# Altium schematic sheet Power Supply.SchDoc
size A4; SheetNumber: 8; SheetTotal: 8
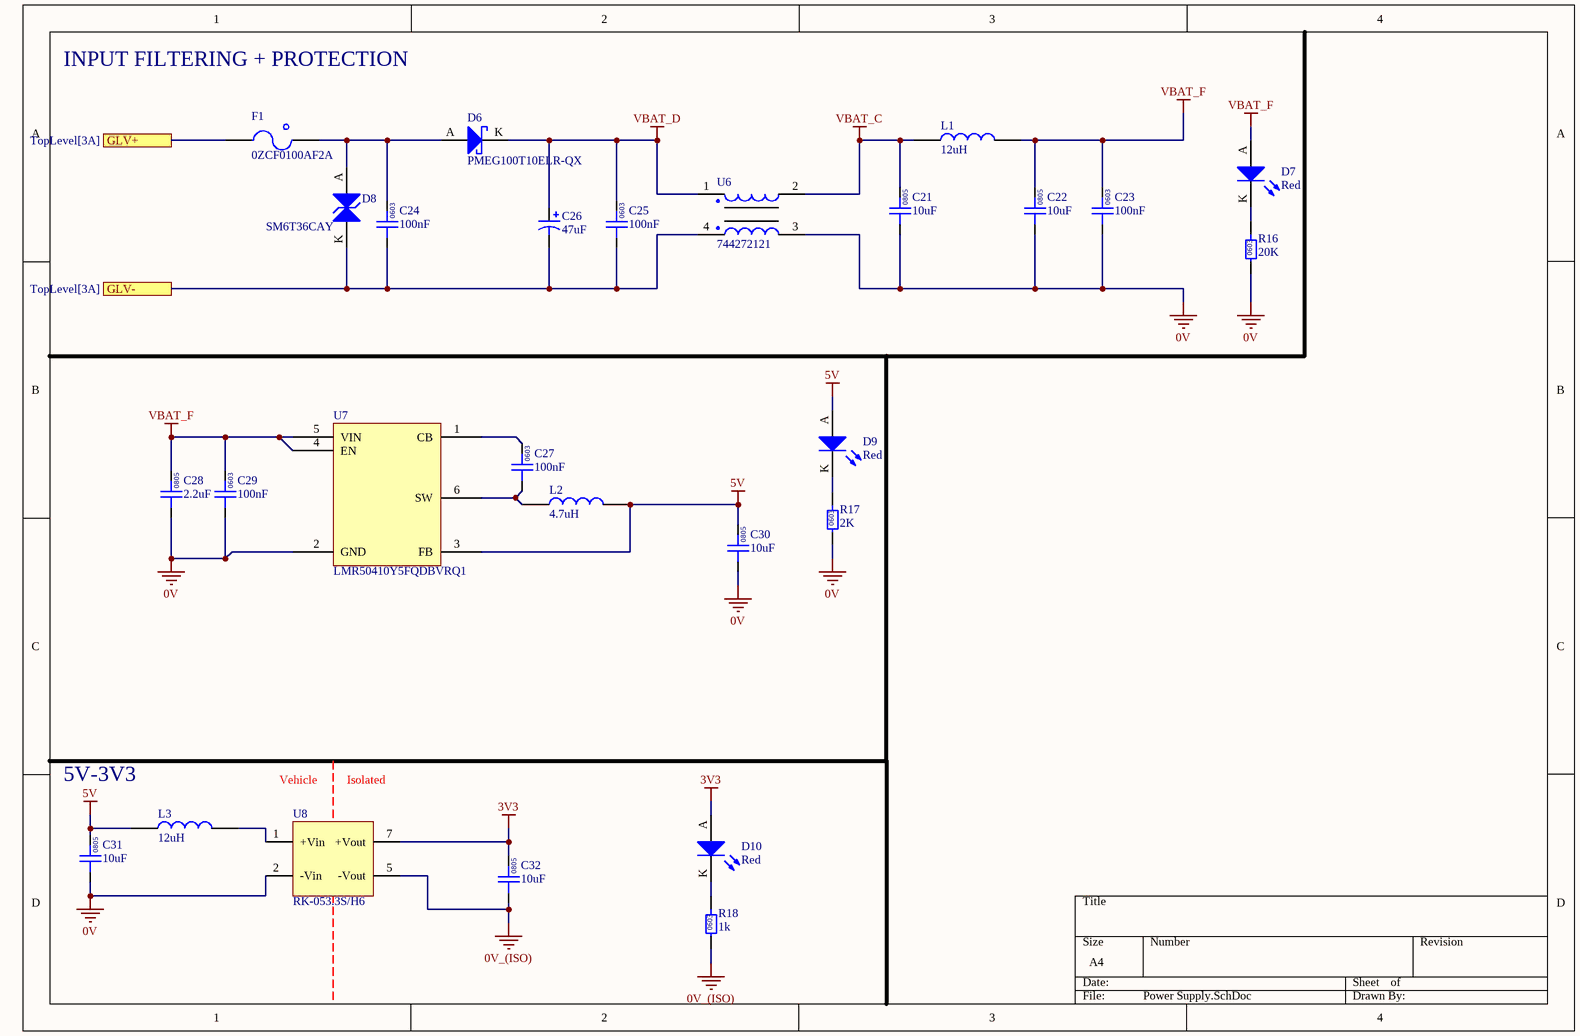
[diagram p0: Power Supply.SchDoc]

## Parts
C21  10uF  [0805]
C22  10uF  [0805]
C23  100nF  [0603]
C24  100nF  [0603]
C25  100nF  [0603]
C26  47uF  [CHEMI-CON ELCO]
C27  100nF  [0603]
C28  2.2uF  [0805]
C29  100nF  [0603]
C30  10uF  [0805]
C31  10uF  [0805]
C32  10uF  [0805]
D6  PMEG100T10ELR-QX  [NXP SOD123W]
D7  Red  [0805 LED]
D8  SM6T36CAY  [ST SMB DIODE]
D9  Red  [0805 LED]
D10  Red  [0805 LED]
F1  0ZCF0100AF2A  [2920]
L1  12uH  [1812]
L2  4.7uH  [SRN3015TA-4R7M]
L3  12uH  [1812]
R16  20K  [0603]
R17  2K  [0603]
R18  1k  [0603]
U6  744272121  [Wurth 4-PC Pad]
U7  LMR50410Y5FQDBVRQ1  [TI-SOT23-6]
U8  RK-053.3S/H6  [RK-053.3S/H6]

## Ports
GLV+ (see TopLevel[3A]), GLV- (see TopLevel[3A])

## Nets
0V: C21.1 C22.1 C23.1 C28.1 C29.1 C30.1 C31.1 R16.1 R17.1 U6.3 U7.2(GND) U8.2(-Vin)
0V_(ISO): C32.1 R18.1 U8.5(-Vout)
3V3: C32.2 D10.A U8.7(+Vout)
5V: C30.2 C31.2 D9.A L2.1 L3.2 U7.3(FB)
VBAT_C: C21.2 L1.2 U6.2
VBAT_D: C25.2 C26.2 D6.K U6.1
VBAT_F: C22.2 C23.2 C28.2 C29.2 D7.A L1.1 U7.4(EN) U7.5(VIN)
GLV+: F1.1 ; port GLV+
GLV-: C24.1 C25.1 C26.1 D8.K U6.4 ; port GLV-
NetC24_2: C24.2 D6.A D8.A F1.2
NetC27_1: C27.1 L2.2 U7.6(SW)
NetC27_2: C27.2 U7.1(CB)
NetD7_K: D7.K R16.2
NetD9_K: D9.K R17.2
NetD10_K: D10.K R18.2
NetL3_1: L3.1 U8.1(+Vin)

## Notes on the sheet
- INPUT FILTERING + PROTECTION
- 5V-3V3
- Vehicle
- Isolated
- (in symbol GCM188L81H104KA57D) 0603
- (in symbol GRM21BR6YA106KE43L) 0805
- (in symbol GRM21BR71E225KE11L) 0805
- (in symbol RC0603FR-071KL) 0603
- (in symbol RC0603FR-072KL) 0603
- (in symbol RC0603FR-0720KL) 0603

## Library data of the parts
C21 C22 C30-C32 = GRM21BR6YA106KE43L: Manufacturer: muRata; Rated Voltage: 50V; Tolerance: 10%; Material: MLCC; Temperature Rating: X5R; Part Number: GRM21BR6YA106KE43L; Value: 10uF; Digikey Part Number: 490-10514-6-ND
C23-C25 C27 C29 = GCM188L81H104KA57D: Manufacturer: muRata; Rated Voltage: 50V; Tolerance: ±10%; Material: MLCC; Temperature Rating: X8L; Part Number: GCM188L81H104KA57D; Value: 100nF; Digikey Part Number: 490-6049-1-ND
C26 = HHXA350ARA470MF61G: Part Number: HHXA350ARA470MF61G
C28 = GRM21BR71E225KE11L: Manufacturer: Murata Electronics; Rated Voltage: 25V; Tolerance: ±10%; Material: MLCC; Temperature Rating: X7R; Part Number: GRM21BR71E225KE11L; Value: 2.2uF; Digikey Part Number: 490-14467-2-ND
D6 = PMEG100T10ELR-QX: Manufacturer: Nexperia USA Inc.; Forward Voltage: 0.75 V @ 1A; Breakdown Voltage: 100 V; Rated Power: 680 mW; Part Number: PMEG100T10ELR-QX; Digikey Part Number: 1727-PMEG100T10ELR-QXCT-ND
D7 D9 D10 = SML-210LTT86: Red LED Indication - Discrete 1.75V 0805 (2012 Metric); Manufacturer: ROHM Semiconductor; Part Number: SML-210LTT86; Colour: Red; Digikey Part Number: 511-1286-1-ND
D8 = SM6T36CAY: Manufacturer: STMicroelectronics; Forward Voltage: 30.8 V; Rated Power: 600W; Part Number: SM6T36CAY; Breakdown Voltage: 30.8 V; Digikey Part Number: 497-10804-1-ND
F1 = 0ZCF0100AF2A: PTC RESET FUSE 60V 1A 292; Manufacturer: Littelfuse Inc.; Part Number: 0ZCF0100AF2A; Digikey Part Number: 507-2070-1-ND; Digikey Link: https://www.digikey.com/product-detail/en/bel-fuse-inc/0ZCF0100AF2A/507-2070-1-ND/6210547
L1 L3 = RLS-126: Manufacturer: Recom; Tolerance: 0.2; Impedance: 230mOhm; Rated Current: 0.8 A; Material: Wirewound; Part Number: RLS-126; Value: 12uH; Digikey Part Number: 945-3429-ND
L2 = SRN4018-4R7M: Manufacturer: Bourns; Tolerance: 0.2; Impedance: 84mOhms; Rated Current: 1.9A; Material: Wirewound; Part Number: SRN4018-4R7M; Value: 4.7uH; Digikey Part Number: SRN3015TA-4R7MCT-ND
R16 = RC0603FR-0720KL: Manufacturer: YAGEO; Tolerance: 0.01; Rated Power: 0.1W; Part Number: RC0603FR-0720KL; Value: 20K; Digikey Part Number: 311-20.0KHRCT-ND; Material: FR-07
R17 = RC0603FR-072KL: Manufacturer: YAGEO; Tolerance: 0.01; Rated Power: 0.1W; Part Number: RC0603FR-072KL; Value: 2K; Digikey Part Number: 311-2.00KHRCT-ND; Material: FR-07
R18 = RC0603FR-071KL: Manufacturer: YAGEO; Tolerance: 0.01; Rated Power: 0.1W; Part Number: RC0603FR-071KL; Value: 1k; Digikey Part Number: 311-1.00KHRCT-ND; Material: FR-07
U6 = 744272121: Manufacturer: Wurth Electronics Inc; Value: 120uH @ 100kHz; Impedance: 460 Ohms @ 30MHz; Rated Current: 2.5 A; Part Number: 744272121; Material: Wirewound; Digikey Part Number: 732-1489-1-ND
U7 = LMR50410-Q1: IC REG BUCK 5V 1A SOT23-6; Manufacturer: Texas Instruments; Input Voltage: 4-36V; Part Number: LMR50410-Q1; Output Voltage: 5V; Output Current: 1A; Digikey Part Number: 296-LMR50410Y5FQDBVRQ1CT-ND
U8 = RK-053.3S/H6: DC DC CONVERTER 3.3V 1W; Manufacturer: Recom; Input Voltage: 5V; Output Current: 303mA; Part Number: RK-053.3S/H6; Output Voltage: 3.3V